# Altium schematic sheet [05] - Final.SchDoc
size Letter; CheckedBy: Pablo M.; DocumentNumber: 5; Revision: v1; SheetNumber: 5; SheetTotal: 5
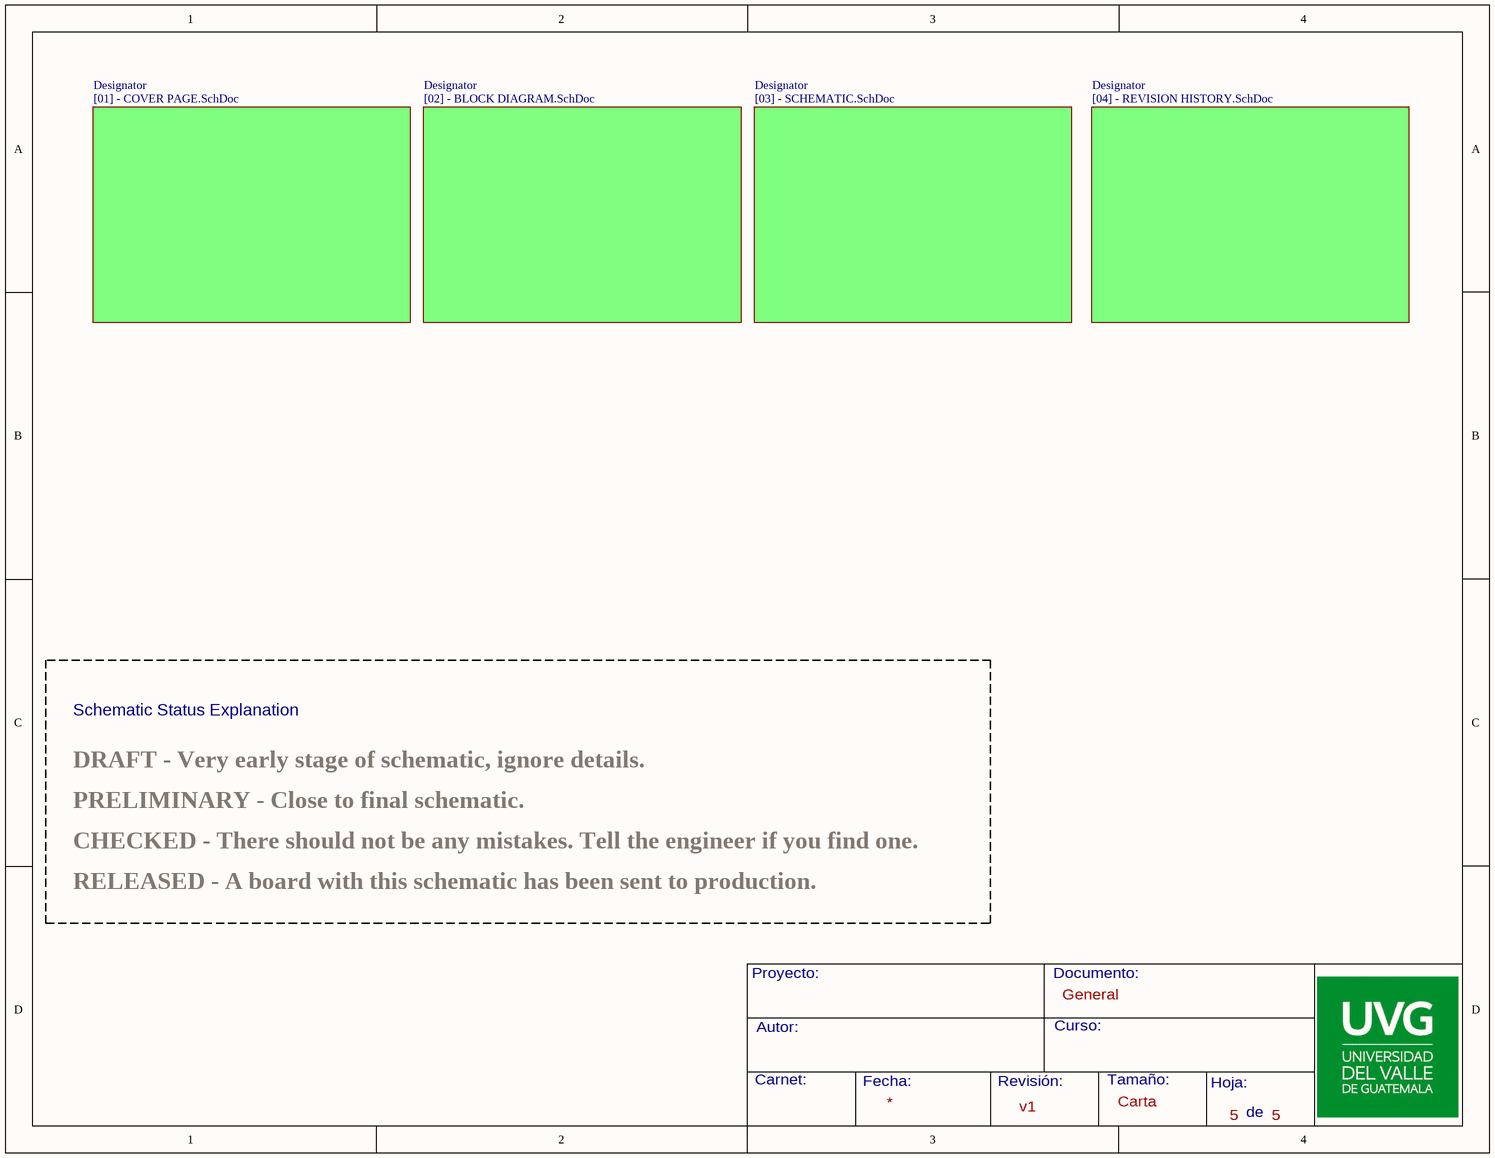
[diagram p0: [05] - Final.SchDoc]

## Sub-sheets
Designator = [01] - COVER PAGE.SchDoc: no entries
Designator = [02] - BLOCK DIAGRAM.SchDoc: no entries
Designator = [03] - SCHEMATIC.SchDoc: no entries
Designator = [04] - REVISION HISTORY.SchDoc: no entries

## Notes on the sheet
- Schematic Status Explanation
- DRAFT - Very early stage of schematic, ignore details.
- PRELIMINARY - Close to final schematic.
- RELEASED - A board with this schematic has been sent to production.
- CHECKED - There should not be any mistakes. Tell the engineer if you find one.
- General
- Proyecto:
- Documento:
- Autor:
- Curso:
- Carnet:
- Fecha:
- Revisión:
- Tamaño:
- Carta
- Hoja:
- de